# Altium schematic sheet QMI8658C.SchDoc
size A4
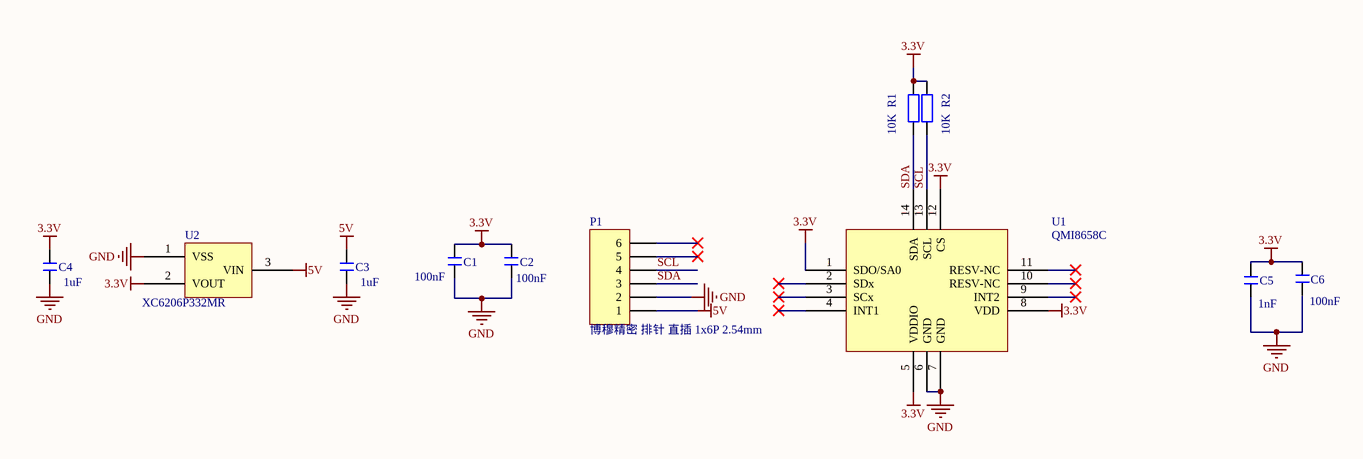
[diagram p0: QMI8658C.SchDoc]

## Parts
C1  值: 100nF  [C 0603_M]  (hidden comment: 100nF 10% X7R 50V 0603)
C2  值: 100nF  [C 0603_M]  (hidden comment: 100nF 10% X7R 50V 0603)
C3  值: 1uF  [C 0603_M]  (hidden comment: 1uF 10% X7R 50V 0603)
C4  值: 1uF  [C 0603_M]  (hidden comment: 1uF 10% X7R 50V 0603)
C5  值: 1nF  [C 0603_M]  (hidden comment: 1nF 10% X7R 50V 0603)
C6  值: 100nF  [C 0603_M]  (hidden comment: 100nF 10% X7R 50V 0603)
P1  博穆精密 排针 直插 1x6P 2.54mm  [HDR1X6]
R1  值: 10K  [R 0603_M]  (hidden comment: 10K 5% 1/10W 0603)
R2  值: 10K  [R 0603_M]  (hidden comment: 10K 5% 1/10W 0603)
U1  QMI8658C  [LGA-14_L3.0-W2.5-P0.50-BR - duplicate]
U2  线性电源IC  UMW XC6206P332MR,SOT23  [SOT-23-3_L3.0-W1.7-P0.95-LS2.9-BR]  (value not drawn)

## Nets
3.3V: C1.2 C2.2 C4.2 C5.2 C6.2 R1.2 R2.2 U1.1(SDO/SA0) U1.5(VDDIO) U1.8(VDD) U1.12(CS) U2.2(VOUT)
5V: C3.2 P1.1 U2.3(VIN)
GND: C1.1 C2.1 C3.1 C4.1 C5.1 C6.1 P1.2 U1.6(GND) U1.7(GND) U2.1(VSS)
SCL: P1.4 R2.1 U1.13(SCL)
SDA: P1.3 R1.1 U1.14(SDA)

Not connected (* = marked no-connect by the designer): P1 5* 6*; U1 2(SDx)* 3(SCx)* 4(INT1)* 9(INT2)* 10(RESV-NC)* 11(RESV-NC)*

## Library data of the parts
C1-C6 = C: 无极性贴片电容; 名称: 贴片电容
P1 = Header 6: Header, 6-Pin; 值: 6P; 名称: 排针
R1 R2 = R: 贴片电阻; 名称: 贴片电阻
U2 = XC6206P332MR: 厂家: 友台半导体; 单价: 0.098388; 值: XC6206P332MR